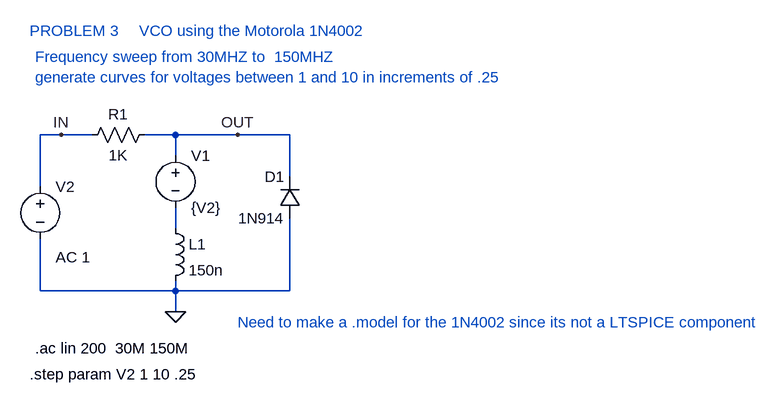
[diagram p0: schematic Problem 3.asc]
Problem 3.asc, the LTspice schematic file:
Version 4
SHEET 1 1036 680
WIRE -192 48 -224 48
WIRE -144 48 -192 48
WIRE -16 48 -64 48
WIRE 80 48 -16 48
WIRE 160 48 80 48
WIRE -16 80 -16 48
WIRE 160 112 160 48
WIRE -224 128 -224 48
WIRE -16 192 -16 160
WIRE -224 288 -224 208
WIRE -16 288 -16 272
WIRE -16 288 -224 288
WIRE 160 288 160 176
WIRE 160 288 -16 288
WIRE -16 320 -16 288
FLAG 80 48 OUT
FLAG -192 48 IN
FLAG -16 320 0
SYMBOL res -160 64 R270
WINDOW 0 32 56 VTop 2
WINDOW 3 0 56 VBottom 2
SYMATTR InstName R1
SYMATTR Value 1K
SYMBOL voltage -16 64 R0
WINDOW 123 0 0 Left 2
WINDOW 39 0 0 Left 2
SYMATTR InstName V1
SYMATTR Value {V2}
SYMBOL diode 176 176 R180
WINDOW 0 24 64 Left 2
WINDOW 3 24 0 Left 2
SYMATTR InstName D1
SYMATTR Value 1N914
SYMATTR Type varactor
SYMBOL ind -32 176 R0
SYMATTR InstName L1
SYMATTR Value 150n
SYMBOL voltage -224 112 R0
WINDOW 123 24 124 Left 2
WINDOW 39 0 0 Left 2
SYMATTR InstName V2
SYMATTR Value ""
SYMATTR Value2 AC 1
TEXT -232 376 Left 2 !.ac lin 200  30M 150M
TEXT -240 416 Left 2 !.step param V2 1 10 .25
TEXT -232 -72 Left 2 ;Frequency sweep from 30MHZ to  150MHZ \ngenerate curves for voltages between 1 and 10 in increments of .25
TEXT -240 -112 Left 2 ;PROBLEM 3
TEXT -72 -112 Left 2 ;VCO using the Motorola 1N4002
TEXT 80 336 Left 2 ;Need to make a .model for the 1N4002 since its not a LTSPICE component

The netlist it stands for:
* Problem 3.asc
R1 IN OUT 1K
V1 OUT N001 {V2}
D1 0 OUT 1N914
L1 N001 0 150n
V2 IN 0 AC 1
.model D D
.lib standard.dio
.ac lin 200  30M 150M
.step param V2 1 10 .25
* Frequency sweep from 30MHZ to  150MHZ
* generate curves for voltages between 1 and 10 in increments of .25
* PROBLEM 3
* VCO using the Motorola 1N4002
* Need to make a .model for the 1N4002 since its not a LTSPICE component
.backanno
.end